# EAGLE schematic cv02hartan (EAGLE 7.7.0)
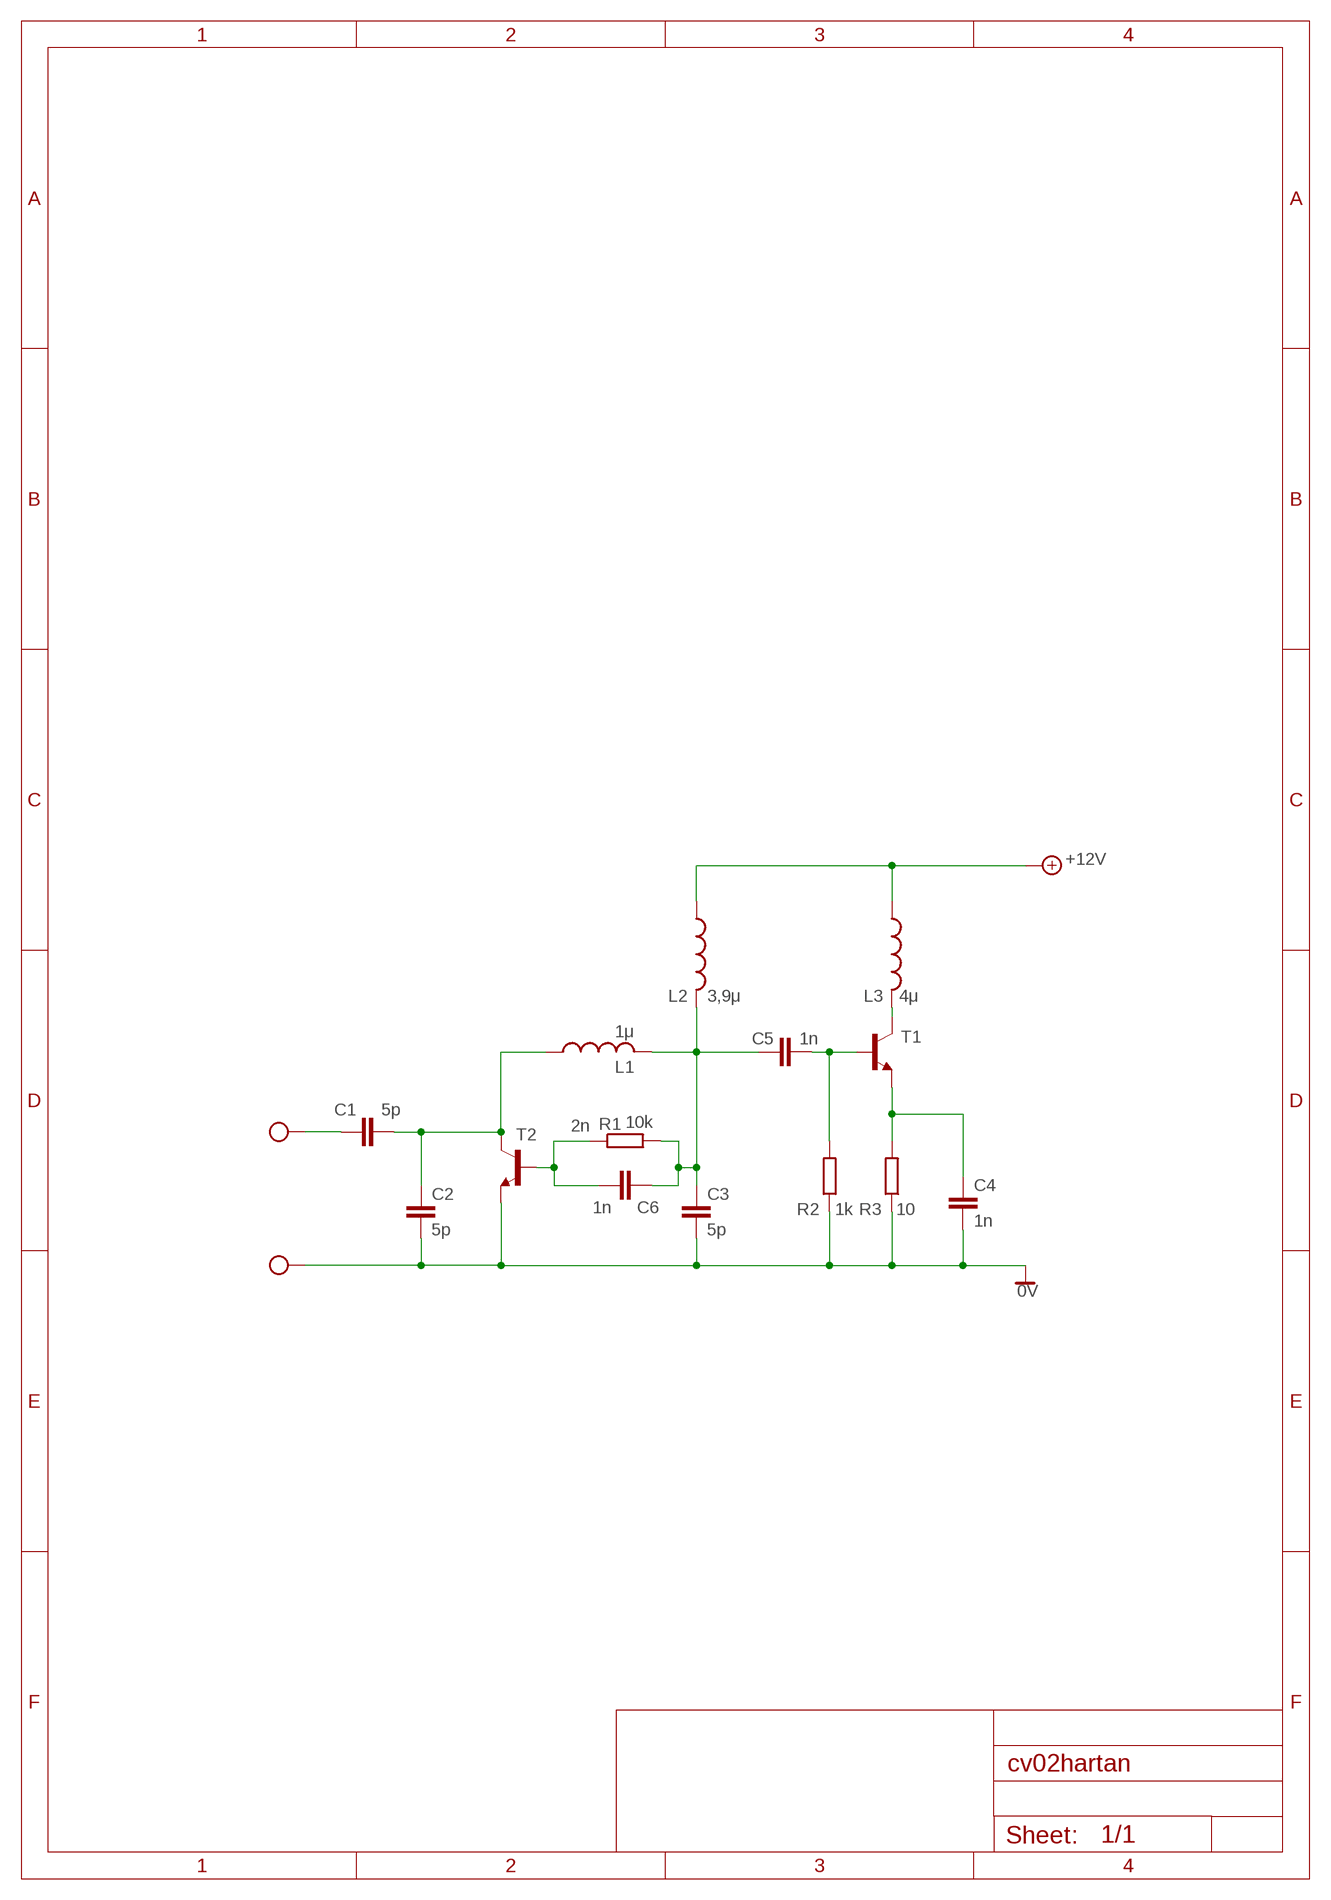
[diagram p0: schematic, sheet 1]

## Parts
C1  5p  C2,5-3  [C2.5-3]
C2  5p  C2,5-3  [C2.5-3]
C3  5p  C2,5-3  [C2.5-3]
C4  1n  C2,5-3  [C2.5-3]
C5  1n  C2,5-3  [C2.5-3]
C6  1n  C-EU025-024X044  [C025-024X044]
L1  1μ  L-US0204/5  [0204/5]
L2  3,9μ  L-US0204/5  [0204/5]
L3  4μ  L-US0204/5  [0204/5]
R1  10k  R-EU_0204/2V  [0204V]
R2  1k  R-EU_0204/2V  [0204V]
R3  10  R-EU_0204/2V  [0204V]
T1  2N2222A-NPN-TO18-EBC  [TO18]
T2  2n  2N2222A-NPN-TO18-EBC  [TO18]

## Nets
+12V: L2.1 L3.1
N$2: C1.2 C2.1 L1.1 T2.3(C)
N$3: L3.2 T1.3(C)
N$4: C3.1 C5.1 C6.1 L1.2 L2.2 R1.2
N$6: C5.2 R2.2 T1.2(B)
N$7: C4.1 R3.2 T1.1(E)
T1: C6.2 R1.1 T2.2(B)
VDD: C1.1 C2.2 C3.2 C4.2 R2.1 R3.1 T2.1(E) ; supply symbol labelled 0V

## Library data of the parts
C1-C5 = capacitor-wima:C: CAPACITOR naming: grid - package width
C6 = rcl:C-EU: CAPACITOR, European symbol
L1-L3 = rcl:L-US: INDUCTOR, American symbol
R1-R3 = rcl:R-EU_: RESISTOR, European symbol
T1 T2 = transistor:*-NPN-: NPN Transistror BF959 corrected 2008.03.06